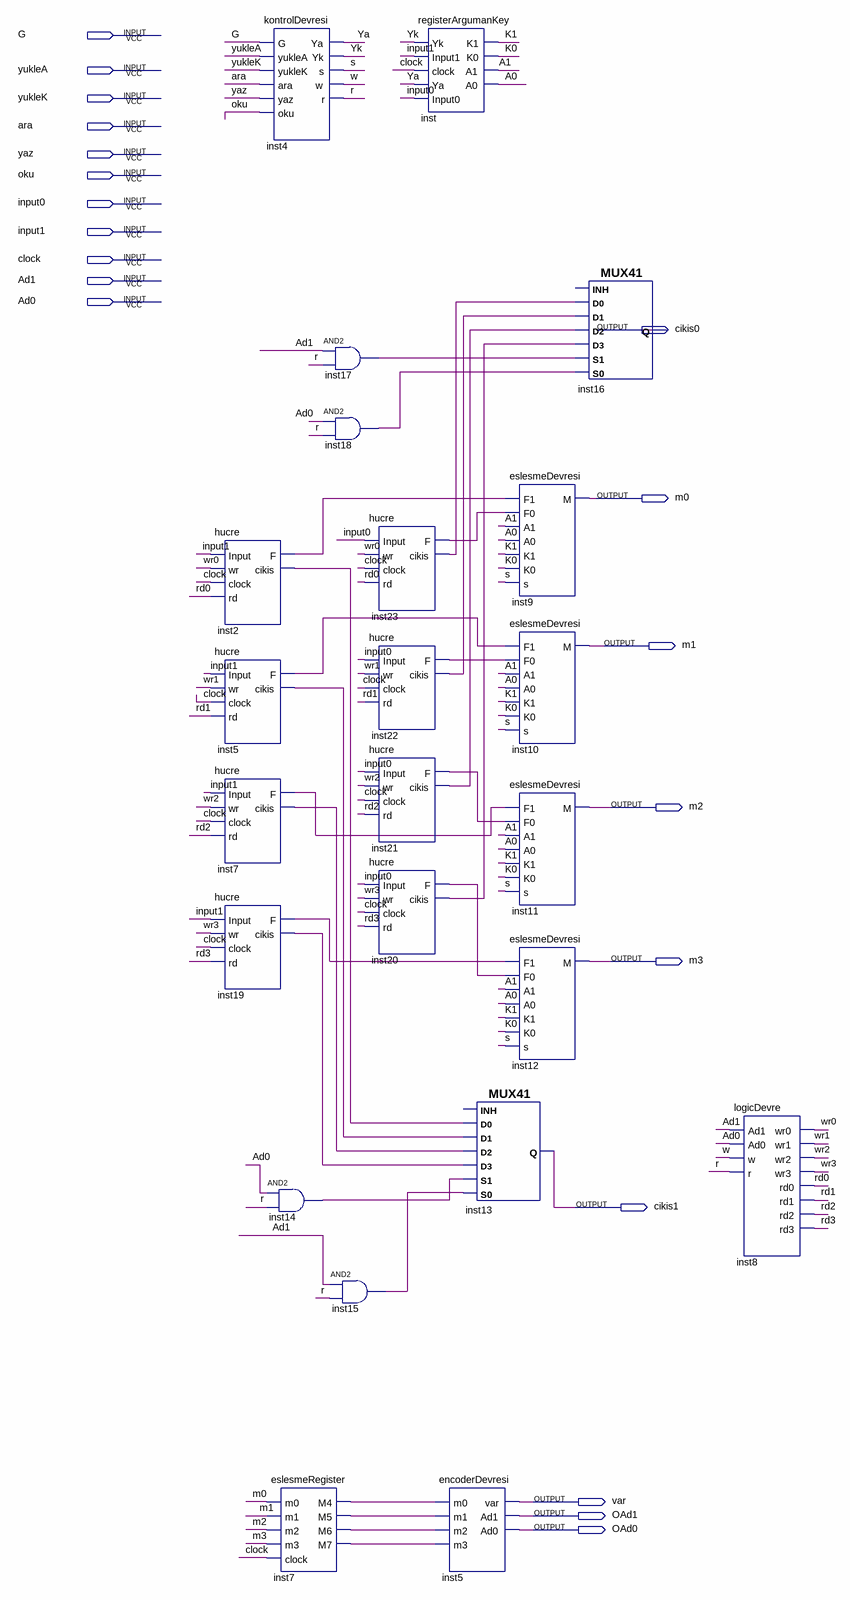
[diagram p0: schematic sheet]
// Quartus schematic AnaDevre.bdf as structural Verilog: 23 symbols, 20 pins
module AnaDevre (
  input  G,
  input  yukleA,
  input  yukleK,
  input  ara,
  input  yaz,
  input  oku,
  input  input0,
  input  input1,
  input  clock,
  input  Ad1,
  input  Ad0,
  output cikis0,
  output m0,
  output m1,
  output m2,
  output m3,
  output cikis1,
  output \var ,
  output OAd1,
  output OAd0
);

  wire A0, A1, inst2_cikis, inst2_f, inst5_cikis, inst5_f, inst7_cikis, inst7_f, inst7_m4, inst7_m5,
       inst7_m6, inst7_m7, inst14_out, inst15_out, inst17_out, inst18_out, inst19_cikis, inst19_f,
       inst20_cikis, inst20_f, inst21_cikis, inst21_f, inst22_cikis, inst22_f, inst23_cikis, inst23_f, K0,
       K1, r, rd0, rd1, rd2, rd3, s, w, wr0, wr1, wr2, wr3, Ya, Yk;

  kontrolDevresi inst4 (
    .G(G), .yukleA(yukleA), .yukleK(yukleK), .ara(ara), .yaz(yaz), .oku(oku), .Ya(Ya), .Yk(Yk), .s(s), .w(w),
    .r(r));
  hucre inst2 (.Input(input1), .wr(wr0), .clock(clock), .rd(rd0), .F(inst2_f), .cikis(inst2_cikis));
  hucre inst5 (.Input(input1), .wr(wr1), .clock(clock), .rd(rd1), .F(inst5_f), .cikis(inst5_cikis));
  hucre inst7 (.Input(input1), .wr(wr2), .clock(clock), .rd(rd2), .F(inst7_f), .cikis(inst7_cikis));
  hucre inst19 (.Input(input1), .wr(wr3), .clock(clock), .rd(rd3), .F(inst19_f), .cikis(inst19_cikis));
  and inst14 (inst14_out, Ad0, r);
  eslesmeRegister inst7_dup2 (
    .m0(m0), .m1(m1), .m2(m2), .m3(m3), .clock(clock), .M4(inst7_m4), .M5(inst7_m5), .M6(inst7_m6),
    .M7(inst7_m7));
  and inst17 (inst17_out, Ad1, r);
  and inst18 (inst18_out, Ad0, r);
  hucre inst23 (.Input(input0), .wr(wr0), .clock(clock), .rd(rd0), .F(inst23_f), .cikis(inst23_cikis));
  hucre inst22 (.Input(input0), .wr(wr1), .clock(clock), .rd(rd1), .F(inst22_f), .cikis(inst22_cikis));
  hucre inst21 (.Input(input0), .wr(wr2), .clock(clock), .rd(rd2), .F(inst21_f), .cikis(inst21_cikis));
  hucre inst20 (.Input(input0), .wr(wr3), .clock(clock), .rd(rd3), .F(inst20_f), .cikis(inst20_cikis));
  and inst15 (inst15_out, Ad1, r);
  registerArgumanKey inst (
    .Yk(Yk), .Input1(input1), .clock(clock), .Ya(Ya), .Input0(input0), .K1(K1), .K0(K0), .A1(A1), .A0(A0));
  MUX41 inst13 (
    .S0(inst15_out), .D2(inst7_cikis), .S1(inst14_out), .D3(inst19_cikis), .D0(inst2_cikis),
    .D1(inst5_cikis), .Q(cikis1));  // open: INH
  encoderDevresi inst5_dup2 (
    .m0(inst7_m4), .m1(inst7_m5), .m2(inst7_m6), .m3(inst7_m7), .\var (\var ), .Ad1(OAd1), .Ad0(OAd0));
  eslesmeDevresi inst9 (.F1(inst2_f), .F0(inst23_f), .A1(A1), .A0(A0), .K1(K1), .K0(K0), .s(s), .M(m0));
  eslesmeDevresi inst10 (.F1(inst5_f), .F0(inst22_f), .A1(A1), .A0(A0), .K1(K1), .K0(K0), .s(s), .M(m1));
  eslesmeDevresi inst11 (.F1(inst7_f), .F0(inst21_f), .A1(A1), .A0(A0), .K1(K1), .K0(K0), .s(s), .M(m2));
  eslesmeDevresi inst12 (.F1(inst19_f), .F0(inst20_f), .A1(A1), .A0(A0), .K1(K1), .K0(K0), .s(s), .M(m3));
  MUX41 inst16 (
    .S0(inst18_out), .D2(inst21_cikis), .S1(inst17_out), .D3(inst20_cikis), .D0(inst23_cikis),
    .D1(inst22_cikis), .Q(cikis0));  // open: INH
  logicDevre inst8 (
    .Ad1(Ad1), .Ad0(Ad0), .w(w), .r(r), .wr0(wr0), .wr1(wr1), .wr2(wr2), .wr3(wr3), .rd0(rd0), .rd1(rd1),
    .rd2(rd2), .rd3(rd3));
endmodule
